# Altium project abacus_magnets.PrjPcb
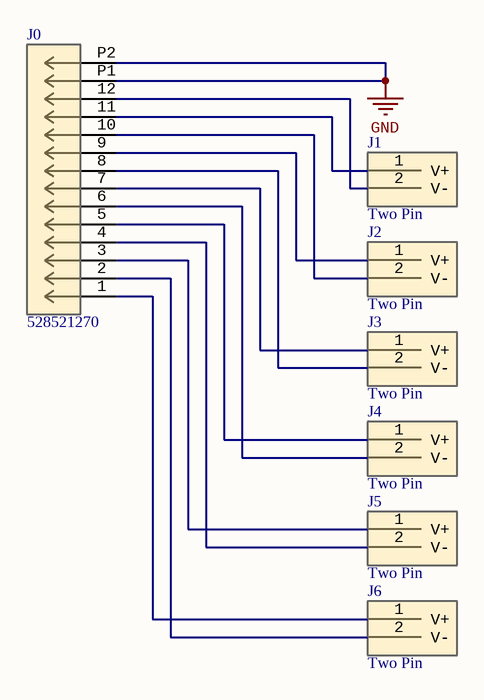
[diagram p0: magnets.SchDoc]
1 sheet, 7 parts. Net scope: global (net labels, ports and power ports of the same name join across sheets).
Board file: magnets_carrier.PcbDoc

## Sheet magnets.SchDoc: Abacus magnets
size A4; DrawnBy: Posheng Cheng; SheetNumber: 1; SheetTotal: 1

### Parts
J0  528521270  [528521270]
J1  Two Pin  [TWO_PIN]
J2  Two Pin  [TWO_PIN]
J3  Two Pin  [TWO_PIN]
J4  Two Pin  [TWO_PIN]
J5  Two Pin  [TWO_PIN]
J6  Two Pin  [TWO_PIN]

### Nets
GND: J0.P1 J0.P2
NetJ0_1: J0.1 J6.1(V+)
NetJ0_2: J0.2 J6.2(V-)
NetJ0_3: J0.3 J5.1(V+)
NetJ0_4: J0.4 J5.2(V-)
NetJ0_5: J0.5 J4.1(V+)
NetJ0_6: J0.6 J4.2(V-)
NetJ0_7: J0.7 J3.1(V+)
NetJ0_8: J0.8 J3.2(V-)
NetJ0_9: J0.9 J2.1(V+)
NetJ0_10: J0.10 J2.2(V-)
NetJ0_11: J0.11 J1.1(V+)
NetJ0_12: J0.12 J1.2(V-)

### Library data of the parts
J0 = 528521270: Easy-On FFC/FPC Connector, 1.00mm Pitch, Surface Mount, Right-Angle, Non-ZIF, Bottom Contact Style, 12 Circuits; Manufacturer_Name: Molex Connector Corporation; Copyright: Copyright (C) 2025 Ultra Librarian. All rights reserved.; Manufacturer_Part_Number: 528521270; RefDes: RefDes; Type: Type; System: Connector
J1-J6 = two_pin